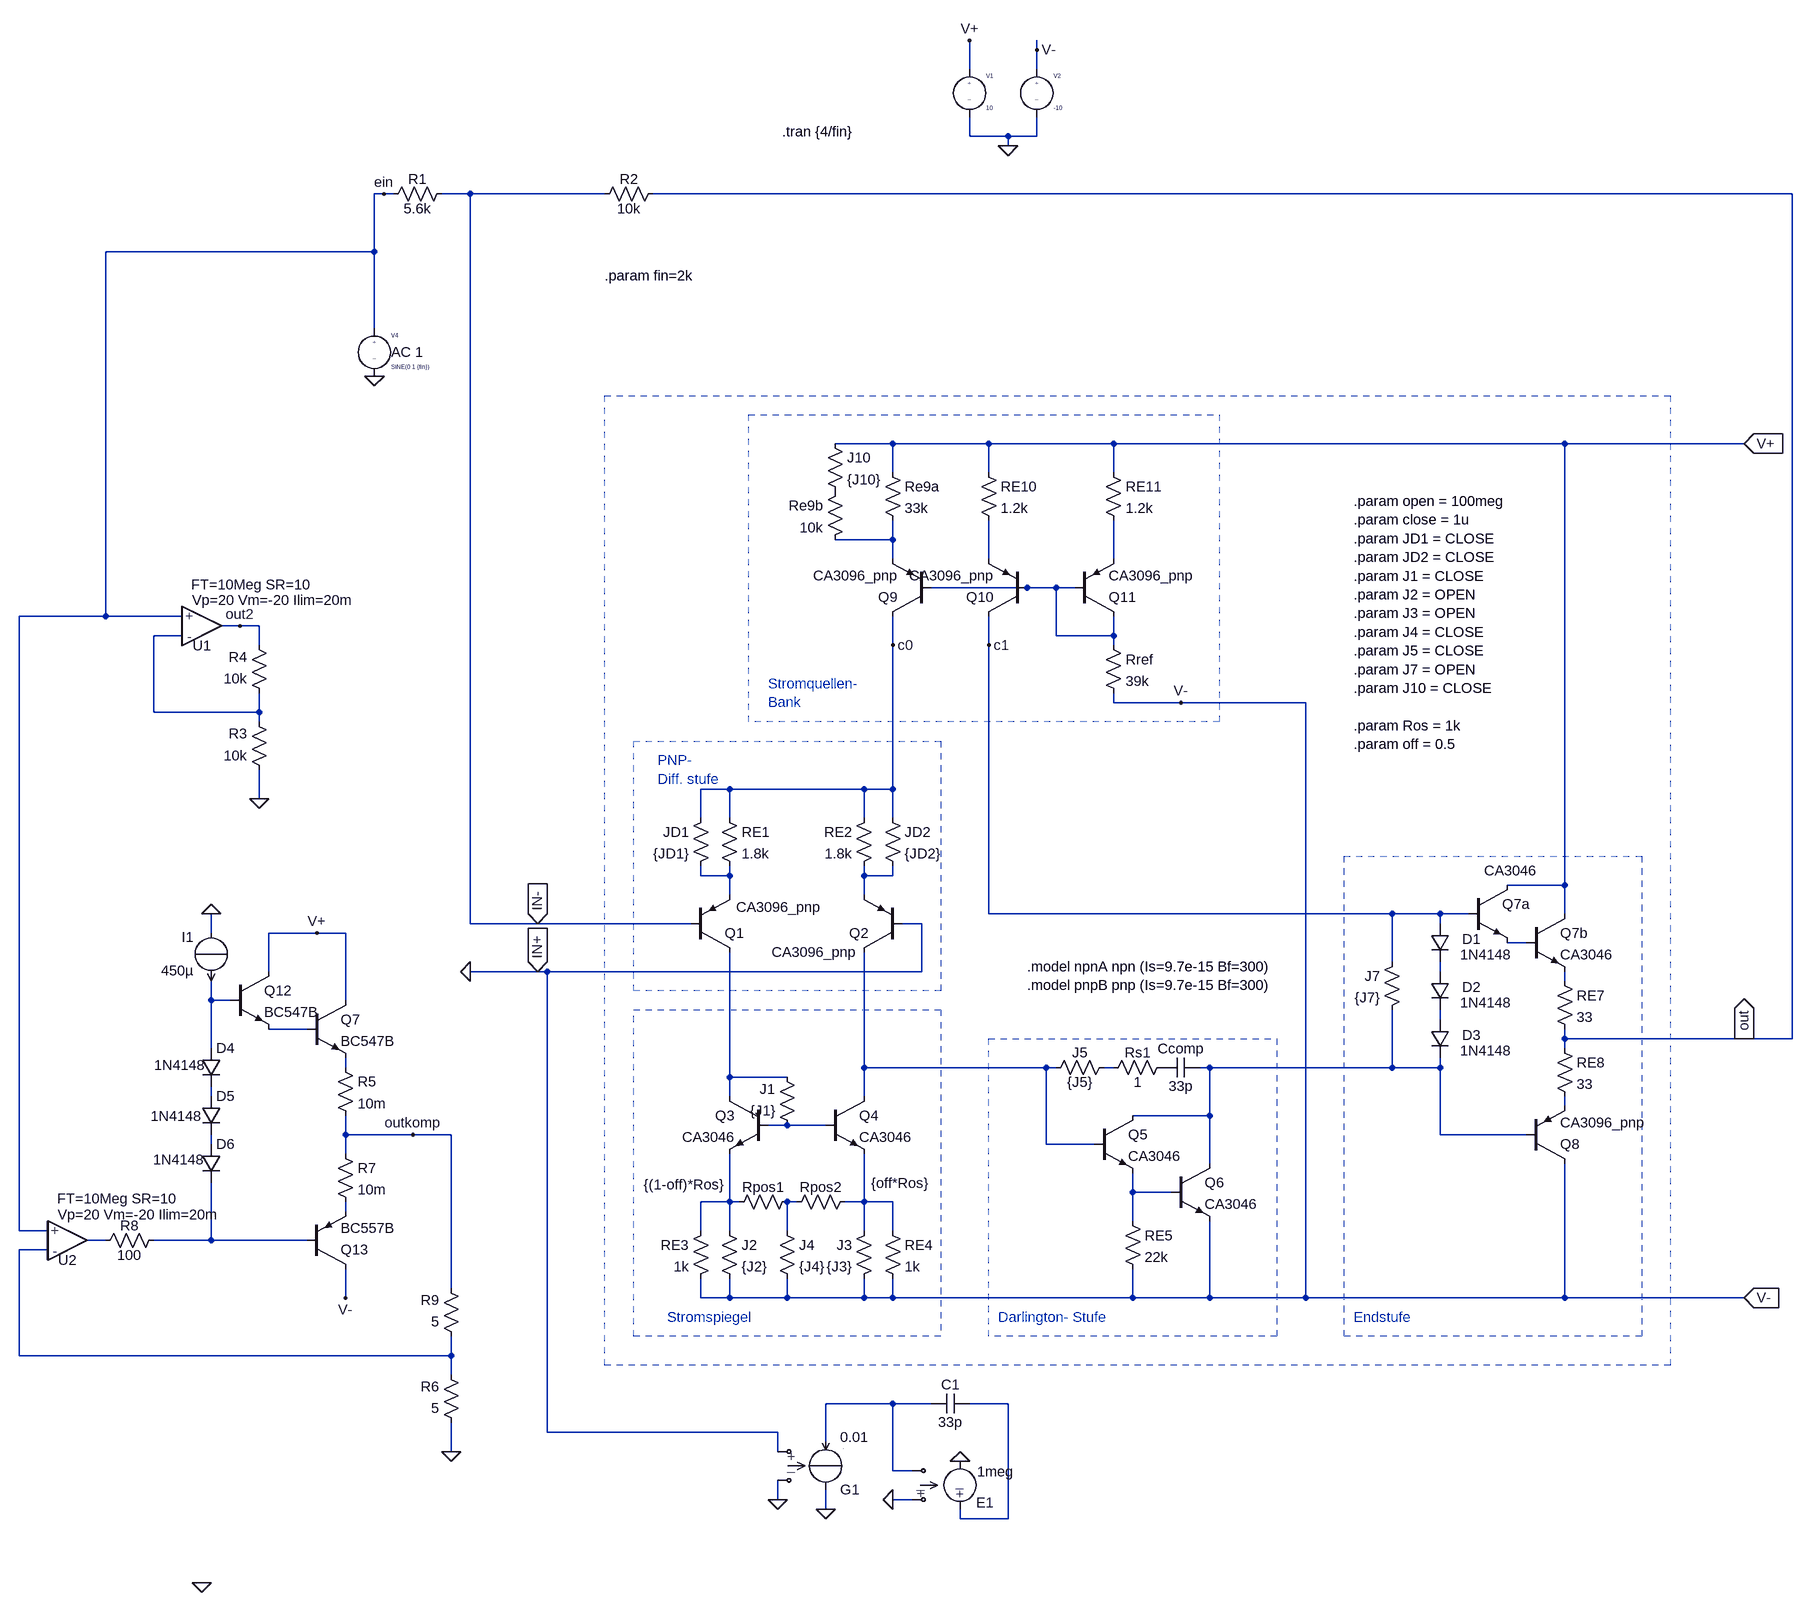
[diagram p0: schematic diskret_op_eas_labor.asc]
diskret_op_eas_labor.asc, the LTspice schematic file:
Version 4
SHEET 1 1188 2276
WIRE -528 -1120 -528 -1136
WIRE -640 -1088 -640 -1136
WIRE -528 -1088 -528 -1120
WIRE -640 -976 -640 -1008
WIRE -576 -976 -640 -976
WIRE -528 -976 -528 -1008
WIRE -528 -976 -576 -976
WIRE -576 -960 -576 -976
WIRE -1616 -880 -1632 -880
WIRE -1600 -880 -1616 -880
WIRE -1472 -880 -1520 -880
WIRE -1248 -880 -1472 -880
WIRE 816 -880 -1168 -880
WIRE -1632 -784 -1632 -880
WIRE -1632 -784 -2080 -784
WIRE -1632 -656 -1632 -784
WIRE -768 -464 -864 -464
WIRE -608 -464 -768 -464
WIRE -400 -464 -608 -464
WIRE 352 -464 -400 -464
WIRE 736 -464 352 -464
WIRE -768 -416 -768 -464
WIRE -608 -416 -608 -464
WIRE -400 -416 -400 -464
WIRE -768 -304 -768 -336
WIRE -768 -304 -864 -304
WIRE -768 -272 -768 -304
WIRE -608 -272 -608 -336
WIRE -400 -272 -400 -336
WIRE -544 -224 -704 -224
WIRE -496 -224 -544 -224
WIRE -464 -224 -496 -224
WIRE -2080 -176 -2080 -784
WIRE -2080 -176 -2224 -176
WIRE -1952 -176 -2080 -176
WIRE -1856 -160 -1888 -160
WIRE -1824 -160 -1856 -160
WIRE -1952 -144 -2000 -144
WIRE -496 -144 -496 -224
WIRE -400 -144 -400 -176
WIRE -400 -144 -496 -144
WIRE -1824 -128 -1824 -160
WIRE -768 -128 -768 -176
WIRE -608 -128 -608 -176
WIRE -400 -128 -400 -144
WIRE -400 -32 -400 -48
WIRE -288 -32 -400 -32
WIRE -80 -32 -288 -32
WIRE -2000 -16 -2000 -144
WIRE -1824 -16 -1824 -48
WIRE -1824 -16 -2000 -16
WIRE -1824 0 -1824 -16
WIRE -1040 112 -1088 112
WIRE -816 112 -1040 112
WIRE -768 112 -768 -128
WIRE -768 112 -816 112
WIRE -1824 128 -1824 80
WIRE -1088 160 -1088 112
WIRE -1040 160 -1040 112
WIRE -816 160 -816 112
WIRE -768 160 -768 112
WIRE -1088 256 -1088 240
WIRE -1040 256 -1040 240
WIRE -1040 256 -1088 256
WIRE -816 256 -816 240
WIRE -768 256 -768 240
WIRE -768 256 -816 256
WIRE 352 272 352 -464
WIRE 352 272 256 272
WIRE -1040 288 -1040 256
WIRE -816 288 -816 256
WIRE -608 320 -608 -128
WIRE 64 320 -608 320
WIRE 144 320 64 320
WIRE 192 320 144 320
WIRE 352 320 352 272
WIRE -1472 336 -1472 -880
WIRE -1360 336 -1472 336
WIRE -1104 336 -1360 336
WIRE -720 336 -752 336
WIRE 144 336 144 320
WIRE -1904 352 -1904 320
WIRE -1728 352 -1808 352
WIRE -1680 352 -1728 352
WIRE 288 368 256 368
WIRE 64 400 64 320
WIRE -1808 416 -1808 352
WIRE -1360 416 -1472 416
WIRE -1344 416 -1360 416
WIRE -720 416 -720 336
WIRE -720 416 -1344 416
WIRE 144 416 144 400
WIRE 352 432 352 416
WIRE -1904 464 -1904 432
WIRE -1872 464 -1904 464
WIRE -1680 464 -1680 352
WIRE 144 496 144 480
WIRE -1744 512 -1808 512
WIRE 352 528 352 512
WIRE 736 528 352 528
WIRE 816 528 816 -880
WIRE 816 528 736 528
WIRE -1904 544 -1904 464
WIRE 352 544 352 528
WIRE -1680 576 -1680 560
WIRE -816 576 -816 384
WIRE -512 576 -816 576
WIRE -496 576 -512 576
WIRE -400 576 -416 576
WIRE -240 576 -256 576
WIRE 64 576 64 480
WIRE 64 576 -240 576
WIRE 144 576 144 560
WIRE 144 576 64 576
WIRE -1040 592 -1040 384
WIRE -944 592 -1040 592
WIRE -1904 624 -1904 608
WIRE -1040 624 -1040 592
WIRE -816 624 -816 576
WIRE 352 640 352 624
WIRE -240 656 -240 576
WIRE -240 656 -368 656
WIRE -944 672 -976 672
WIRE -880 672 -944 672
WIRE -1680 688 -1680 656
WIRE -1568 688 -1680 688
WIRE -1504 688 -1568 688
WIRE 144 688 144 576
WIRE 288 688 144 688
WIRE -1904 704 -1904 688
WIRE -512 704 -512 576
WIRE -432 704 -512 704
WIRE -1680 720 -1680 688
WIRE -240 736 -240 656
WIRE -368 784 -368 752
WIRE -304 784 -368 784
WIRE -1040 800 -1040 720
WIRE -1040 800 -1088 800
WIRE -1024 800 -1040 800
WIRE -928 800 -944 800
WIRE -816 800 -816 720
WIRE -816 800 -848 800
WIRE -768 800 -816 800
WIRE -1680 816 -1680 800
WIRE -368 832 -368 784
WIRE -2224 848 -2224 -176
WIRE -2176 848 -2224 848
WIRE -1088 848 -1088 800
WIRE -1040 848 -1040 800
WIRE -944 848 -944 800
WIRE -816 848 -816 800
WIRE -768 848 -768 800
WIRE -2080 864 -2112 864
WIRE -1904 864 -1904 768
WIRE -1904 864 -2000 864
WIRE -1744 864 -1904 864
WIRE -2176 880 -2224 880
WIRE -1504 944 -1504 688
WIRE -1680 960 -1680 912
WIRE -1088 960 -1088 928
WIRE -1040 960 -1040 928
WIRE -1040 960 -1088 960
WIRE -944 960 -944 928
WIRE -944 960 -1040 960
WIRE -816 960 -816 928
WIRE -816 960 -944 960
WIRE -768 960 -768 928
WIRE -768 960 -816 960
WIRE -368 960 -368 912
WIRE -368 960 -768 960
WIRE -240 960 -240 832
WIRE -240 960 -368 960
WIRE -80 960 -80 -32
WIRE -80 960 -240 960
WIRE 352 960 352 736
WIRE 352 960 -80 960
WIRE 736 960 352 960
WIRE -2224 1056 -2224 880
WIRE -1504 1056 -1504 1024
WIRE -1504 1056 -2224 1056
WIRE -1504 1088 -1504 1056
WIRE -768 1136 -880 1136
WIRE -704 1136 -768 1136
WIRE -576 1136 -640 1136
WIRE -1344 1184 -1344 416
WIRE -960 1184 -1344 1184
WIRE -880 1200 -880 1136
WIRE -1504 1216 -1504 1168
WIRE -960 1216 -960 1184
WIRE -768 1248 -768 1136
WIRE -736 1248 -768 1248
WIRE -960 1296 -960 1264
WIRE -736 1296 -768 1296
WIRE -880 1312 -880 1280
WIRE -656 1328 -656 1312
WIRE -576 1328 -576 1136
WIRE -576 1328 -656 1328
FLAG 736 -464 V+
IOPIN 736 -464 In
FLAG -288 -32 V-
FLAG -768 -128 c0
FLAG -608 -128 c1
FLAG -1360 416 IN+
IOPIN -1360 416 In
FLAG -1360 336 IN-
IOPIN -1360 336 In
FLAG 736 960 V-
IOPIN 736 960 In
FLAG 736 528 out
IOPIN 736 528 Out
FLAG -576 -960 0
FLAG -640 -1136 V+
FLAG -528 -1120 V-
FLAG -1616 -880 ein
FLAG -1920 2256 0
FLAG -880 1312 0
FLAG -768 1296 0
FLAG -656 1232 0
FLAG -1472 416 0
FLAG -960 1296 0
FLAG -1632 -576 0
FLAG -1856 -160 out2
FLAG -1680 960 V-
FLAG -1728 352 V+
FLAG -1824 128 0
FLAG -1504 1216 0
FLAG -1904 320 0
FLAG -1568 688 outkomp
SYMBOL EIT_Semiconductors\\pnp -704 -176 R180
SYMATTR InstName Q9
SYMATTR Value CA3096_pnp
SYMBOL EIT_Semiconductors\\pnp -544 -176 R180
SYMATTR InstName Q10
SYMATTR Value CA3096_pnp
SYMBOL EIT_Semiconductors\\pnp -464 -176 M180
SYMATTR InstName Q11
SYMATTR Value CA3096_pnp
SYMBOL res -416 -432 R0
SYMATTR InstName RE11
SYMATTR Value 1.2k
SYMBOL res -624 -432 R0
SYMATTR InstName RE10
SYMATTR Value 1.2k
SYMBOL res -784 -432 R0
SYMATTR InstName Re9a
SYMATTR Value 33k
SYMBOL res -848 -400 M0
SYMATTR InstName Re9b
SYMATTR Value 10k
SYMBOL res -416 -144 R0
SYMATTR InstName Rref
SYMATTR Value 39k
SYMBOL EIT_Semiconductors\\pnp -752 384 R180
WINDOW 3 77 0 Left 2
SYMATTR Value CA3096_pnp
SYMATTR InstName Q2
SYMBOL EIT_Semiconductors\\pnp -1104 384 M180
WINDOW 3 75 75 Left 2
SYMATTR Value CA3096_pnp
SYMATTR InstName Q1
SYMBOL res -1056 144 R0
SYMATTR InstName RE1
SYMATTR Value 1.8k
SYMBOL res -800 144 M0
SYMATTR InstName RE2
SYMATTR Value 1.8k
SYMBOL res -1072 144 M0
SYMATTR InstName JD1
SYMATTR Value {JD1}
SYMBOL res -784 144 R0
SYMATTR InstName JD2
SYMATTR Value {JD2}
SYMBOL EIT_Semiconductors\\npn -976 624 M0
SYMATTR InstName Q3
SYMATTR Value CA3046
SYMBOL EIT_Semiconductors\\npn -880 624 R0
SYMATTR InstName Q4
SYMATTR Value CA3046
SYMBOL res -928 784 R90
WINDOW 0 7 56 VBottom 2
WINDOW 3 -28 188 VTop 2
SYMATTR InstName Rpos1
SYMATTR Value {(1-off)*Ros}
SYMBOL res -1056 832 R0
SYMATTR InstName J2
SYMATTR Value {J2}
SYMBOL res -800 832 M0
SYMATTR InstName J3
SYMATTR Value {J3}
SYMBOL res -1072 832 M0
SYMATTR InstName RE3
SYMATTR Value 1k
SYMBOL res -784 832 R0
SYMATTR InstName RE4
SYMATTR Value 1k
SYMBOL res -928 688 R180
WINDOW 0 36 76 Left 2
WINDOW 3 36 40 Left 2
SYMATTR InstName J1
SYMATTR Value {J1}
SYMBOL res -832 784 R90
WINDOW 0 7 56 VBottom 2
WINDOW 3 -31 -76 VTop 2
SYMATTR InstName Rpos2
SYMATTR Value {off*Ros}
SYMBOL res -960 832 R0
SYMATTR InstName J4
SYMATTR Value {J4}
SYMBOL res -512 592 R270
WINDOW 0 25 56 VTop 2
WINDOW 3 7 56 VBottom 2
SYMATTR InstName J5
SYMATTR Value {J5}
SYMBOL cap -256 560 R90
WINDOW 0 0 32 VBottom 2
WINDOW 3 32 32 VTop 2
SYMATTR InstName Ccomp
SYMATTR Value 33p
SYMBOL EIT_Semiconductors\\npn -304 736 R0
SYMATTR InstName Q6
SYMATTR Value CA3046
SYMBOL EIT_Semiconductors\\npn -432 656 R0
SYMATTR InstName Q5
SYMATTR Value CA3046
SYMBOL res -384 816 R0
SYMATTR InstName RE5
SYMATTR Value 22k
SYMBOL EIT_Semiconductors\\npn 288 320 R0
SYMATTR InstName Q7b
SYMATTR Value CA3046
SYMBOL EIT_Semiconductors\\npn 192 272 R0
WINDOW 3 26 -24 Left 2
SYMATTR Value CA3046
SYMATTR InstName Q7a
SYMBOL EIT_Semiconductors\\pnp 288 736 M180
SYMATTR InstName Q8
SYMATTR Value CA3096_pnp
SYMBOL res 336 416 R0
SYMATTR InstName RE7
SYMATTR Value 33
SYMBOL res 336 528 R0
SYMATTR InstName RE8
SYMATTR Value 33
SYMBOL diode 128 336 R0
WINDOW 0 53 26 Left 2
WINDOW 3 50 52 Left 2
SYMATTR InstName D1
SYMATTR Value 1N4148
SYMBOL res 80 384 M0
SYMATTR InstName J7
SYMATTR Value {J7}
SYMBOL res -1504 -896 R90
WINDOW 0 7 56 VBottom 2
WINDOW 3 25 56 VTop 2
SYMATTR InstName R1
SYMATTR Value 5.6k
SYMBOL res -1152 -896 R90
WINDOW 0 7 56 VBottom 2
WINDOW 3 25 56 VTop 2
SYMATTR InstName R2
SYMATTR Value 10k
SYMBOL source-V -640 -1104 R0
WINDOW 123 0 0 Left 2
WINDOW 39 0 0 Left 2
SYMATTR InstName V1
SYMATTR Value 10
SYMBOL source-V -528 -1104 R0
WINDOW 123 0 0 Left 2
WINDOW 39 0 0 Left 2
SYMATTR InstName V2
SYMATTR Value -10
SYMBOL res -304 560 R90
WINDOW 0 7 56 VBottom 2
WINDOW 3 25 56 VTop 2
SYMATTR InstName Rs1
SYMATTR Value 1
SYMBOL crtl-V-V -656 1328 M180
SYMATTR InstName E1
SYMATTR Value 1meg
SYMBOL cap -640 1120 R90
WINDOW 0 0 32 VBottom 2
WINDOW 3 32 32 VTop 2
SYMATTR InstName C1
SYMATTR Value 33p
SYMBOL crtl-V-I_INV -880 1184 R0
SYMATTR InstName G1
SYMATTR Value 0.01
SYMBOL source-V -1632 -672 R0
WINDOW 123 28 56 Left 2
WINDOW 39 0 0 Left 2
SYMATTR Value2 AC 1
SYMATTR InstName V4
SYMATTR Value SINE(0 1 {fin})
SYMBOL diode 128 416 R0
WINDOW 0 53 26 Left 2
WINDOW 3 50 52 Left 2
SYMATTR InstName D2
SYMATTR Value 1N4148
SYMBOL diode 128 496 R0
WINDOW 0 53 26 Left 2
WINDOW 3 50 52 Left 2
SYMATTR InstName D3
SYMATTR Value 1N4148
SYMBOL res -880 -480 R0
SYMATTR InstName J10
SYMATTR Value {J10}
SYMBOL EIT_Semiconductors\\op_3 -1920 -160 M180
SYMATTR InstName U1
SYMATTR Value Vp=20 Vm=-20 Ilim=20m
SYMBOL res -1808 96 R180
WINDOW 0 36 76 Left 2
WINDOW 3 36 40 Left 2
SYMATTR InstName R3
SYMATTR Value 10k
SYMBOL res -1808 -32 R180
WINDOW 0 36 76 Left 2
WINDOW 3 36 40 Left 2
SYMATTR InstName R4
SYMATTR Value 10k
SYMBOL EIT_Semiconductors\\npn -1744 464 R0
SYMATTR InstName Q7
SYMATTR Value BC547B
SYMBOL EIT_Semiconductors\\pnp -1744 912 M180
SYMATTR InstName Q13
SYMATTR Value BC557B
SYMBOL EIT_Semiconductors\\op_3 -2144 864 M180
SYMATTR InstName U2
SYMATTR Value Vp=20 Vm=-20 Ilim=20m
SYMBOL res -1488 1184 R180
WINDOW 0 36 76 Left 2
WINDOW 3 36 40 Left 2
SYMATTR InstName R6
SYMATTR Value 5
SYMBOL res -1488 1040 R180
WINDOW 0 36 76 Left 2
WINDOW 3 36 40 Left 2
SYMATTR InstName R9
SYMATTR Value 5
SYMBOL EIT_Semiconductors\\npn -1872 416 R0
SYMATTR InstName Q12
SYMATTR Value BC547B
SYMBOL diode -1920 544 R0
WINDOW 3 -79 28 Left 2
SYMATTR Value 1N4148
SYMATTR InstName D4
SYMBOL diode -1920 624 R0
WINDOW 3 -85 33 Left 2
SYMATTR Value 1N4148
SYMATTR InstName D5
SYMBOL diode -1920 704 R0
WINDOW 3 -81 26 Left 2
SYMATTR Value 1N4148
SYMATTR InstName D6
SYMBOL res -1696 560 R0
SYMATTR InstName R5
SYMATTR Value 10m
SYMBOL res -1696 704 R0
SYMATTR InstName R7
SYMATTR Value 10m
SYMBOL source-I -1904 432 R180
WINDOW 0 29 73 Left 2
WINDOW 3 29 17 Left 2
WINDOW 123 0 0 Left 2
WINDOW 39 0 0 Left 2
SYMATTR InstName I1
SYMATTR Value 450µ
SYMBOL res -1984 848 R90
WINDOW 0 7 56 VBottom 2
WINDOW 3 25 56 VTop 2
SYMATTR InstName R8
SYMATTR Value 100
TEXT -976 -64 Left 2 ;Stromquellen-\nBank
TEXT -1160 64 Left 2 ;PNP-\nDiff. stufe
TEXT -1144 992 Left 2 ;Stromspiegel
TEXT -592 992 Left 2 ;Darlington- Stufe
TEXT 0 992 Left 2 ;Endstufe
TEXT 0 -368 Left 2 !.param open = 100meg\n.param close = 1u\n.param JD1 = CLOSE\n.param JD2 = CLOSE\n.param J1 = CLOSE\n.param J2 = OPEN\n.param J3 = OPEN\n.param J4 = CLOSE\n.param J5 = CLOSE\n.param J7 = OPEN\n.param J10 = CLOSE\n \n.param Ros = 1k\n.param off = 0.5
TEXT -952 -984 Left 2 !.tran {4/fin}
TEXT -544 408 Left 2 !.model npnA npn (Is=9.7e-15 Bf=300)\n.model pnpB pnp (Is=9.7e-15 Bf=300)
TEXT -1248 -744 Left 2 !.param fin=2k
RECTANGLE Normal -224 0 -1008 -512 2
RECTANGLE Normal -688 448 -1200 32 2
RECTANGLE Normal -688 1024 -1200 480 2
RECTANGLE Normal -128 1024 -608 528 2
RECTANGLE Normal 480 1024 -16 224 2
RECTANGLE Normal 528 1072 -1248 -544 1

The netlist it stands for:
* diskret_op_eas_labor.asc
Q9 c0 N004 N001 0 CA3096_pnp
Q10 c1 N004 N002 0 CA3096_pnp
Q11 N004 N004 N003 0 CA3096_pnp
RE11 V+ N003 1.2k
RE10 V+ N002 1.2k
Re9a V+ N001 33k
Re9b P001 N001 10k
Rref N004 V- 39k
Q2 N015 0 N007 0 CA3096_pnp
Q1 N018 IN- N006 0 CA3096_pnp
RE1 c0 N006 1.8k
RE2 c0 N007 1.8k
R§JD1 c0 N006 {JD1}
R§JD2 c0 N007 {JD2}
Q3 N018 N021 N024 0 CA3046
Q4 N015 N021 N026 0 CA3046
Rpos1 N025 N024 {(1-off)*Ros}
R§J2 N024 V- {J2}
R§J3 N026 V- {J3}
RE3 N024 V- 1k
RE4 N026 V- 1k
R§J1 N021 N018 {J1}
Rpos2 N026 N025 {off*Ros}
R§J4 N025 V- {J4}
R§J5 N015 N016 {J5}
Ccomp N017 P002 33p
Q6 N017 N023 V- 0 CA3046
Q5 N017 N015 N023 0 CA3046
RE5 N023 V- 22k
Q7b V+ N008 N010 0 CA3046
Q7a V+ c1 N008 0 CA3046
Q8 V- N017 N020 0 CA3096_pnp
RE7 N010 out 33
RE8 out N020 33
D1 c1 N009 1N4148
R§J7 c1 N017 {J7}
R1 IN- ein 5.6k
R2 out IN- 10k
V1 V+ 0 10
V2 V- 0 -10
Rs1 P002 N016 1
E1 N032 0 0 N031 1meg
C1 N032 N031 33p
G1 N031 0 0 0 0.01
V4 ein 0 SINE(0 1 {fin}) AC 1
D2 N009 N012 1N4148
D3 N012 N017 1N4148
R§J10 V+ P001 {J10}
XU1 ein N005 out2 opamp_param_3 Vp=20 Vm=-20 Ilim=20m FT=10Meg SR=10 Vos=0 A0=100k phir=45 en=0 enk=0 in=0 ink=0 Rin=500Meg  ; pins In+ In- OUT
R3 0 N005 10k
R4 N005 out2 10k
Q7 V+ N013 N014 0 BC547B
Q13 V- N029 N027 0 BC557B
XU2 ein N030 N028 opamp_param_3 Vp=20 Vm=-20 Ilim=20m FT=10Meg SR=10 Vos=0 A0=100k phir=45 en=0 enk=0 in=0 ink=0 Rin=500Meg  ; pins In+ In- OUT
R6 0 N030 5
R9 N030 outkomp 5
Q12 V+ N011 N013 0 BC547B
D4 N011 N019 1N4148
D5 N019 N022 1N4148
D6 N022 N029 1N4148
R5 N014 outkomp 10m
R7 outkomp N027 10m
I1 0 N011 450µ
R8 N029 N028 100
.model D D
.lib standard.dio
.model NPN NPN
.model PNP PNP
.lib standard.bjt
* Stromquellen-
* Bank
* PNP-
* Diff. stufe
* Stromspiegel
* Darlington- Stufe
* Endstufe
.param open = 100meg
.param close = 1u
.param JD1 = CLOSE
.param JD2 = CLOSE
.param J1 = CLOSE
.param J2 = OPEN
.param J3 = OPEN
.param J4 = CLOSE
.param J5 = CLOSE
.param J7 = OPEN
.param J10 = CLOSE
.param Ros = 1k
.param off = 0.5
.tran {4/fin}
.model npnA npn (Is=9.7e-15 Bf=300)
.model pnpB pnp (Is=9.7e-15 Bf=300)
.param fin=2k
.lib EIT_sub\opamp_parametrierbar.sub
.backanno
.end